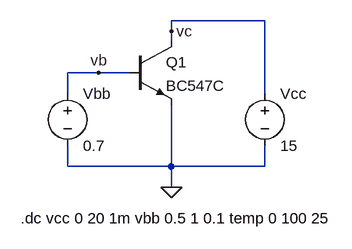
[diagram p0: schematic bjt_curves_ic_vs_vce_param_vbe.asc]
bjt_curves_ic_vs_vce_param_vbe.asc, the LTspice schematic file:
Version 4
SHEET 1 880 680
WIRE 368 48 224 48
WIRE 224 64 224 48
WIRE 224 80 224 64
WIRE 112 128 64 128
WIRE 160 128 112 128
WIRE 64 160 64 128
WIRE 368 160 368 48
WIRE 64 272 64 240
WIRE 224 272 224 176
WIRE 224 272 64 272
WIRE 368 272 368 240
WIRE 368 272 224 272
WIRE 224 304 224 272
FLAG 224 304 0
FLAG 112 128 vb
FLAG 224 64 vc
SYMBOL voltage 64 144 R0
WINDOW 123 0 0 Left 0
WINDOW 39 0 0 Left 0
SYMATTR InstName Vbb
SYMATTR Value 0.7
SYMBOL voltage 368 144 R0
WINDOW 123 0 0 Left 0
WINDOW 39 0 0 Left 0
SYMATTR InstName Vcc
SYMATTR Value 15
SYMBOL npn 160 80 R0
SYMATTR InstName Q1
SYMATTR Value BC547C
TEXT -8 352 Left 2 !.dc vcc 0 20 1m vbb 0.5 1 0.1 temp 0 100 25

The netlist it stands for:
* bjt_curves_ic_vs_vce_param_vbe.asc
Vbb vb 0 0.7
Vcc vc 0 15
Q1 vc vb 0 0 BC547C
.model NPN NPN
.model PNP PNP
.lib standard.bjt
.dc vcc 0 20 1m vbb 0.5 1 0.1 temp 0 100 25
.backanno
.end